# Altium project key_pcb_assy FPC.PrjPCB
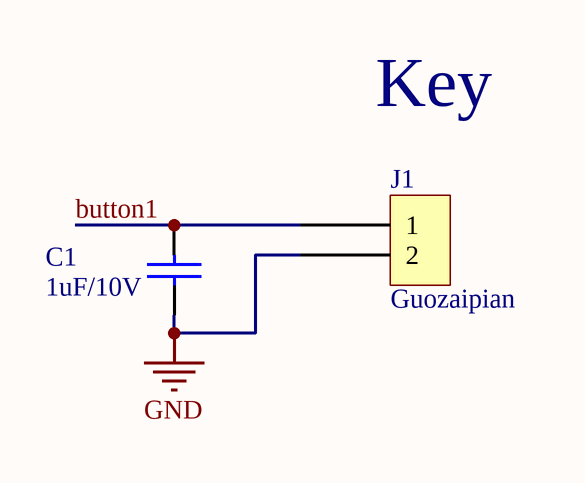
[diagram p0: key_pcb_assy FPC.SchDoc]
1 sheet, 2 parts. Net scope: global (net labels, ports and power ports of the same name join across sheets).
Board file: key_pcb_assy FPC.PcbDoc

## Sheet key_pcb_assy FPC.SchDoc
size A4

### Parts
C1  1uF/10V  [0402C]
J1  Guozaipian  [5MM GUOZHAIPIAN]

### Nets
GND: C1.2 J1.2
button1: C1.1 J1.1

### Notes on the sheet
- (near J1) Key

### Library data of the parts
C1 = CAP: 厂家：Murata，型号：GRM155R71A104KA01D
J1 = Guozaipian: Guozaipian switch